# EAGLE design Termrf_v2 (EAGLE 5.07)
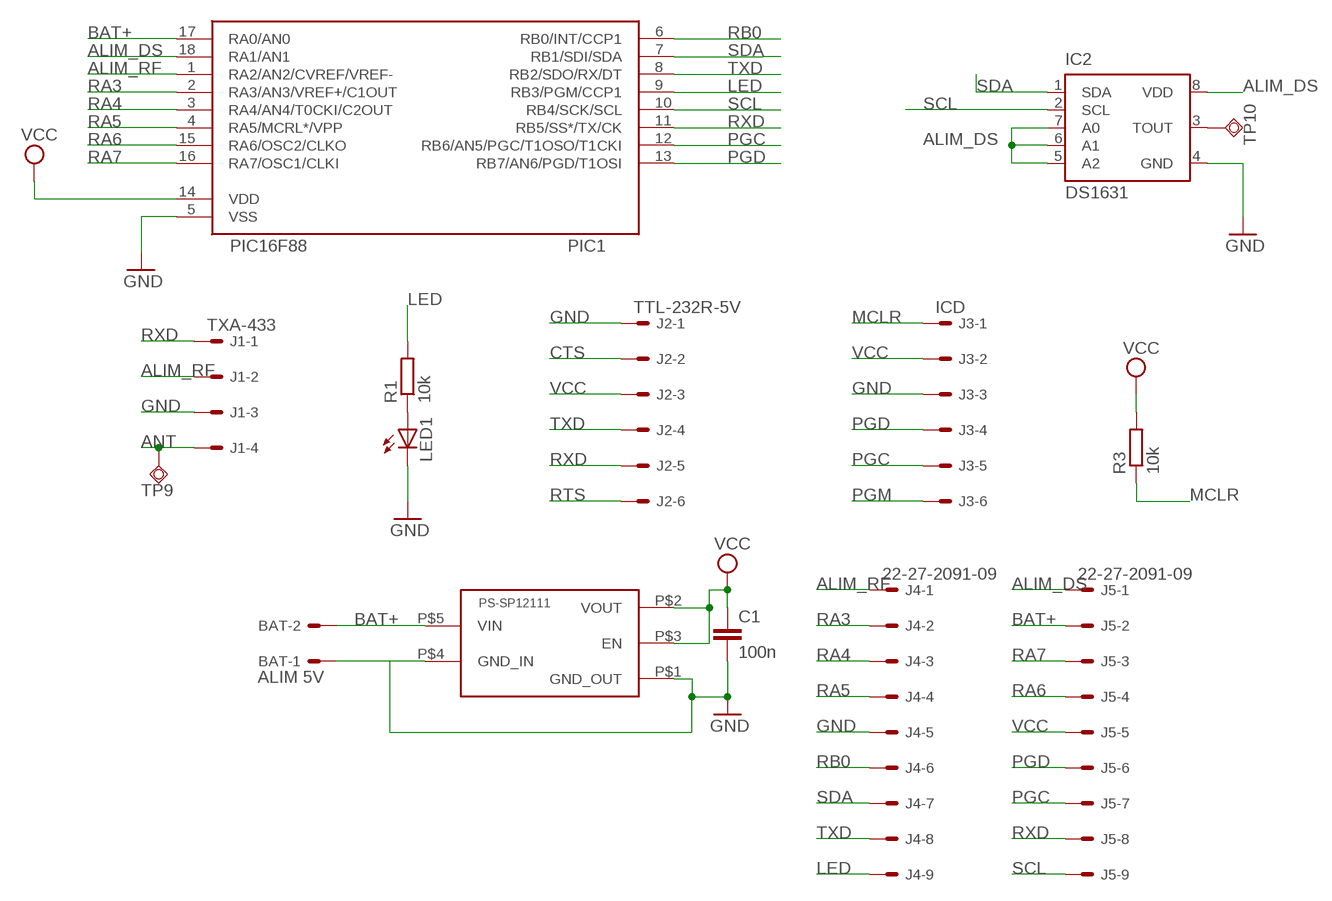
[diagram p0: schematic, sheet 1]

## Parts
BAT  ALIM 5V  22-23-2021  [22-23-2021]
C1  100n  C-EU050-035X075  [C050-035X075]
IC2  DS1631  DS1621  [DIL08]
J1  TXA-433  22-27-2041-04  [6410-04]
J2  TTL-232R-5V  22-27-2061-06  [6410-06]
J3  ICD  22-27-2061-06  [6410-06]
J4  22-27-2091-09  [6410-09]
J5  22-27-2091-09  [6410-09]
LED1  LED3MM  [LED3MM]
PIC1  PIC16F88  [DIL18]
R1  10k  R-EU_0309/10  [0309/10]
R3  10k  R-EU_0309/10  [0309/10]
TP9  TPSQPAD1-13  [P1-13]
TP10  TPSQPAD1-13  [P1-13]
U$1  PS-SP12111  [PS-SP12111]

## Nets
ALIM_DS: IC2.5(A2) IC2.6(A1) IC2.7(A0) IC2.8(VDD) J5.1 PIC1.18(RA1/AN1)
ALIM_RF: J1.2 J4.1 PIC1.1(RA2/AN2/CVREF/VREF-)
ANT: J1.4 TP9.TP
BAT+: BAT.2 J5.2 PIC1.17(RA0/AN0) U$1.P$5(VIN)
CTS: J2.2
GND: BAT.1 C1.2 IC2.4(GND) J1.3 J2.1 J3.3 J4.5 LED1.K(C) PIC1.5(VSS) U$1.P$1(GND_OUT) U$1.P$4(GND_IN)
LED: J4.9 PIC1.9(RB3/PGM/CCP1) R1.2
MCLR: J3.1 R3.1
N$1: LED1.A R1.1
N$5: IC2.3(TOUT) TP10.TP
PGC: J3.5 J5.7 PIC1.12(RB6/AN5/PGC/T1OSO/T1CKI)
PGD: J3.4 J5.6 PIC1.13(RB7/AN6/PGD/T1OSI)
PGM: J3.6
RA3: J4.2 PIC1.2(RA3/AN3/VREF+/C1OUT)
RA4: J4.3 PIC1.3(RA4/AN4/T0CKI/C2OUT)
RA5: J4.4 PIC1.4(RA5/MCRL*/VPP)
RA6: J5.4 PIC1.15(RA6/OSC2/CLKO)
RA7: J5.3 PIC1.16(RA7/OSC1/CLKI)
RB0: J4.6 PIC1.6(RB0/INT/CCP1)
RTS: J2.6
RXD: J1.1 J2.5 J5.8 PIC1.11(RB5/SS*/TX/CK)
SCL: IC2.2(SCL) J5.9 PIC1.10(RB4/SCK/SCL)
SDA: IC2.1(SDA) J4.7 PIC1.7(RB1/SDI/SDA)
TXD: J2.4 J4.8 PIC1.8(RB2/SDO/RX/DT)
VCC: C1.1 J2.3 J3.2 J5.5 PIC1.14(VDD) R3.2 U$1.P$2(VOUT) U$1.P$3(EN)

## Library data of the parts
BAT = con-molex:22-23-2021: .100" (2.54mm) Center Header - 2 Pin
C1 = resistor:C-EU: CAPACITOR, European symbol
IC2 = maxim:DS1621: Digital Thermometer and Thermostat Source: http://pdfserv.maxim-ic.com/en/ds/DS1621.pdf
J1 = con-molex:22-?-04: CONNECTOR wire to board 2.54 mm (.1 inch) pitch header
J2 J3 = con-molex:22-?-06: CONNECTOR wire to board 2.54 mm (.1 inch) pitch header
J4 J5 = con-molex:22-?-09: CONNECTOR wire to board 2.54 mm (.1 inch) pitch header
LED1 = led:LED: LED OSRAM: - CHIPLED LG R971, LG N971, LY N971, LG Q971, LY Q971, LO R971, LY R971 LH N974, LH R974 LS Q976, LO Q976, LY Q976 LO Q996 - Hyper CHIPLED LW Q18S LB Q993, LB Q99A, LB R99A - SideLED LS A670, LO A670, LY A670, LG A670, LP A670 LB A673, LV A673, LT A673, LW A673 LH A674 LY A675 LS A676, LA A676, LO A676, LY A676, LW A676 LS A679, LY A679, LG A679 - Hyper Micro SIDELED® LS Y876, LA Y876, LO Y876, LY Y876 LT Y87S - SmartLED LW L88C, LW L88S LB L89C, LB L89S, LG L890 LS L89K, LO L89K, LY L89K LS L896, LA L896, LO L896, LY L896 - TOPLED LS T670, LO T670, LY T670, LG T670, LP T670 LSG T670, LSP T670, LSY T670, LOP T670, LYG T670 LG T671, LOG T671, LSG T671 LB T673, LV T673, LT T673, LW T673 LH T674 LS T676, LA T676, LO T676, LY T676, LB T676, LH T676, LSB T676, LW T676 LB T67C, LV T67C, LT T67C, LS T67K, LO T67K, LY T67K, LW E67C LS E67B, LA E67B, LO E67B, LY E67B, LB E67C, LV E67C, LT E67C LW T67C LS T679, LY T679, LG T679 LS T770, LO T770, LY T770, LG T770, LP T770 LB T773, LV T773, LT T773, LW T773 LH T774 LS E675, LA E675, LY E675, LS T675 LS T776, LA T776, LO T776, LY T776, LB T776 LHGB T686 LT T68C, LB T68C - Hyper Mini TOPLED® LB M676 - Mini TOPLED Santana® LG M470 LS M47K, LO M47K, LY M47K Source: http://www.osram.convergy.de LUXEON: - LUMILED® LXK2-PW12-R00, LXK2-PW12-S00, LXK2-PW14-U00, LXK2-PW14-V00 LXK2-PM12-R00, LXK2-PM12-S00, LXK2-PM14-U00 LXK2-PE12-Q00, LXK2-PE12-R00, LXK2-PE12-S00, LXK2-PE14-T00, LXK2-PE14-U00 LXK2-PB12-K00, LXK2-PB12-L00, LXK2-PB12-M00, LXK2-PB14-N00, LXK2-PB14-P00, LXK2-PB14-Q00 LXK2-PR12-L00, LXK2-PR12-M00, LXK2-PR14-Q00, LXK2-PR14-R00 LXK2-PD12-Q00, LXK2-PD12-R00, LXK2-PD12-S00 LXK2-PH12-R00, LXK2-PH12-S00 LXK2-PL12-P00, LXK2-PL12-Q00, LXK2-PL12-R00 Source: www.luxeon.com KINGBRIGHT: KA-3528ASYC Source: www.kingbright.com
PIC1 = pic16f88-v0.1:PIC16F88
R1 R3 = rcl:R-EU_: RESISTOR, European symbol
TP9 TP10 = testpad:TPSQ: Test pad
U$1 = sure:PS-SP12111

## Board
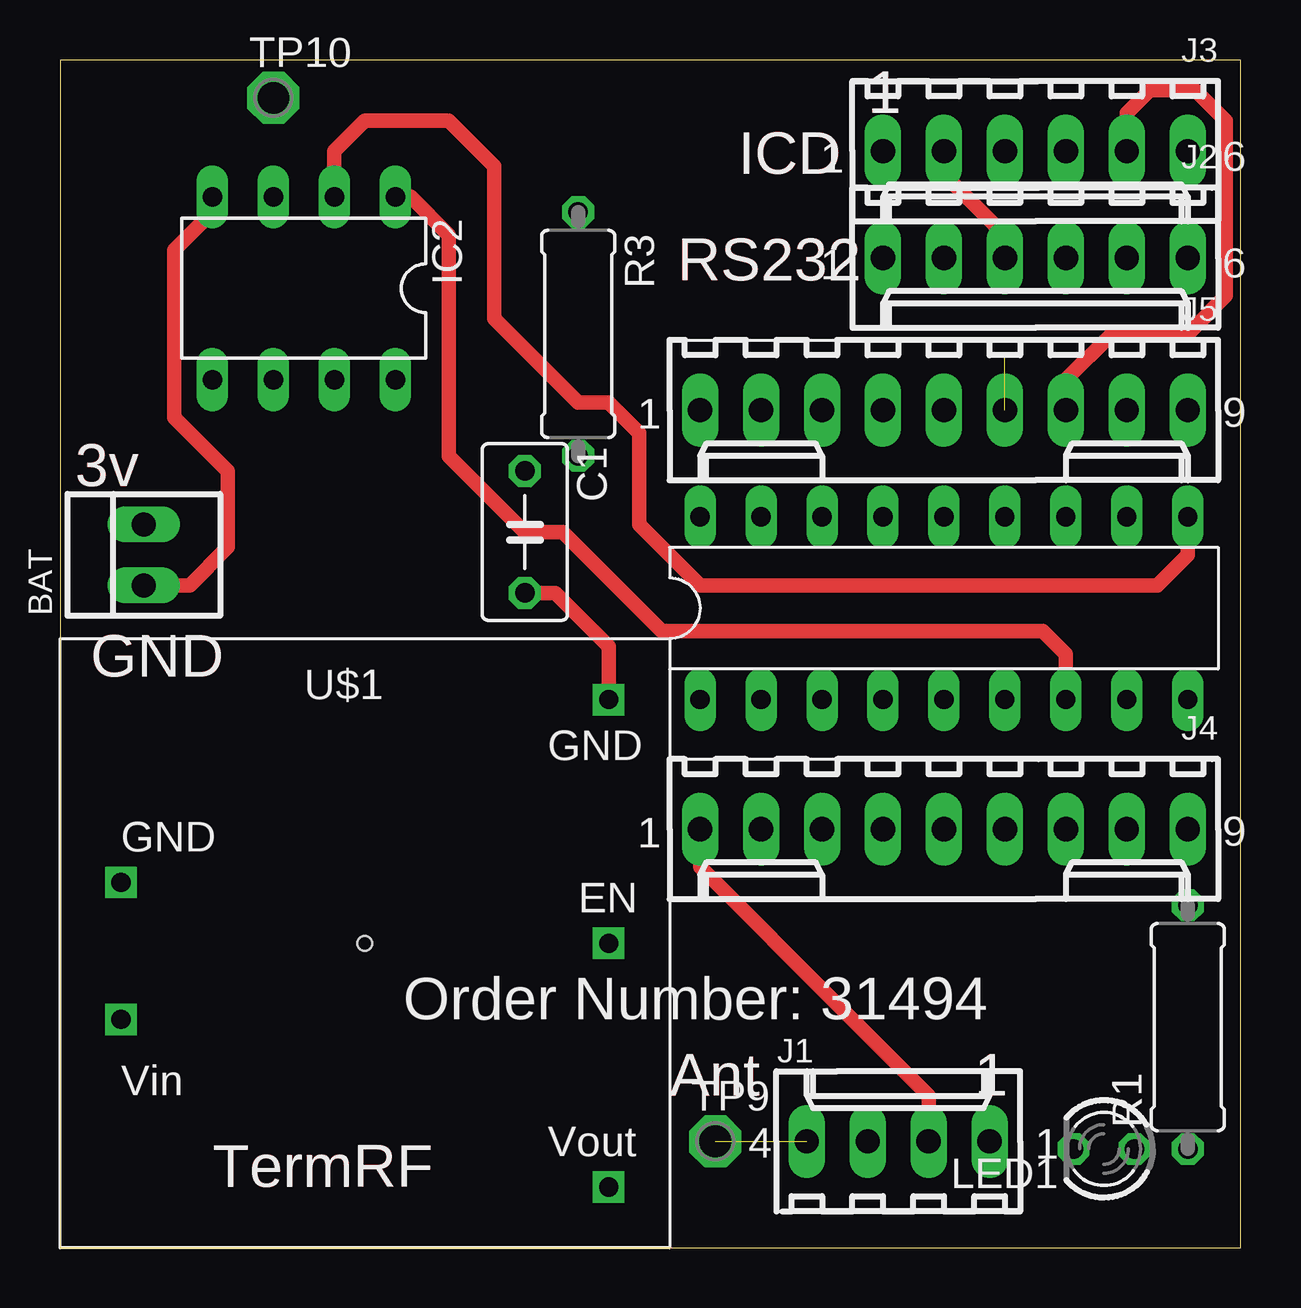
[diagram p1: board, top side]
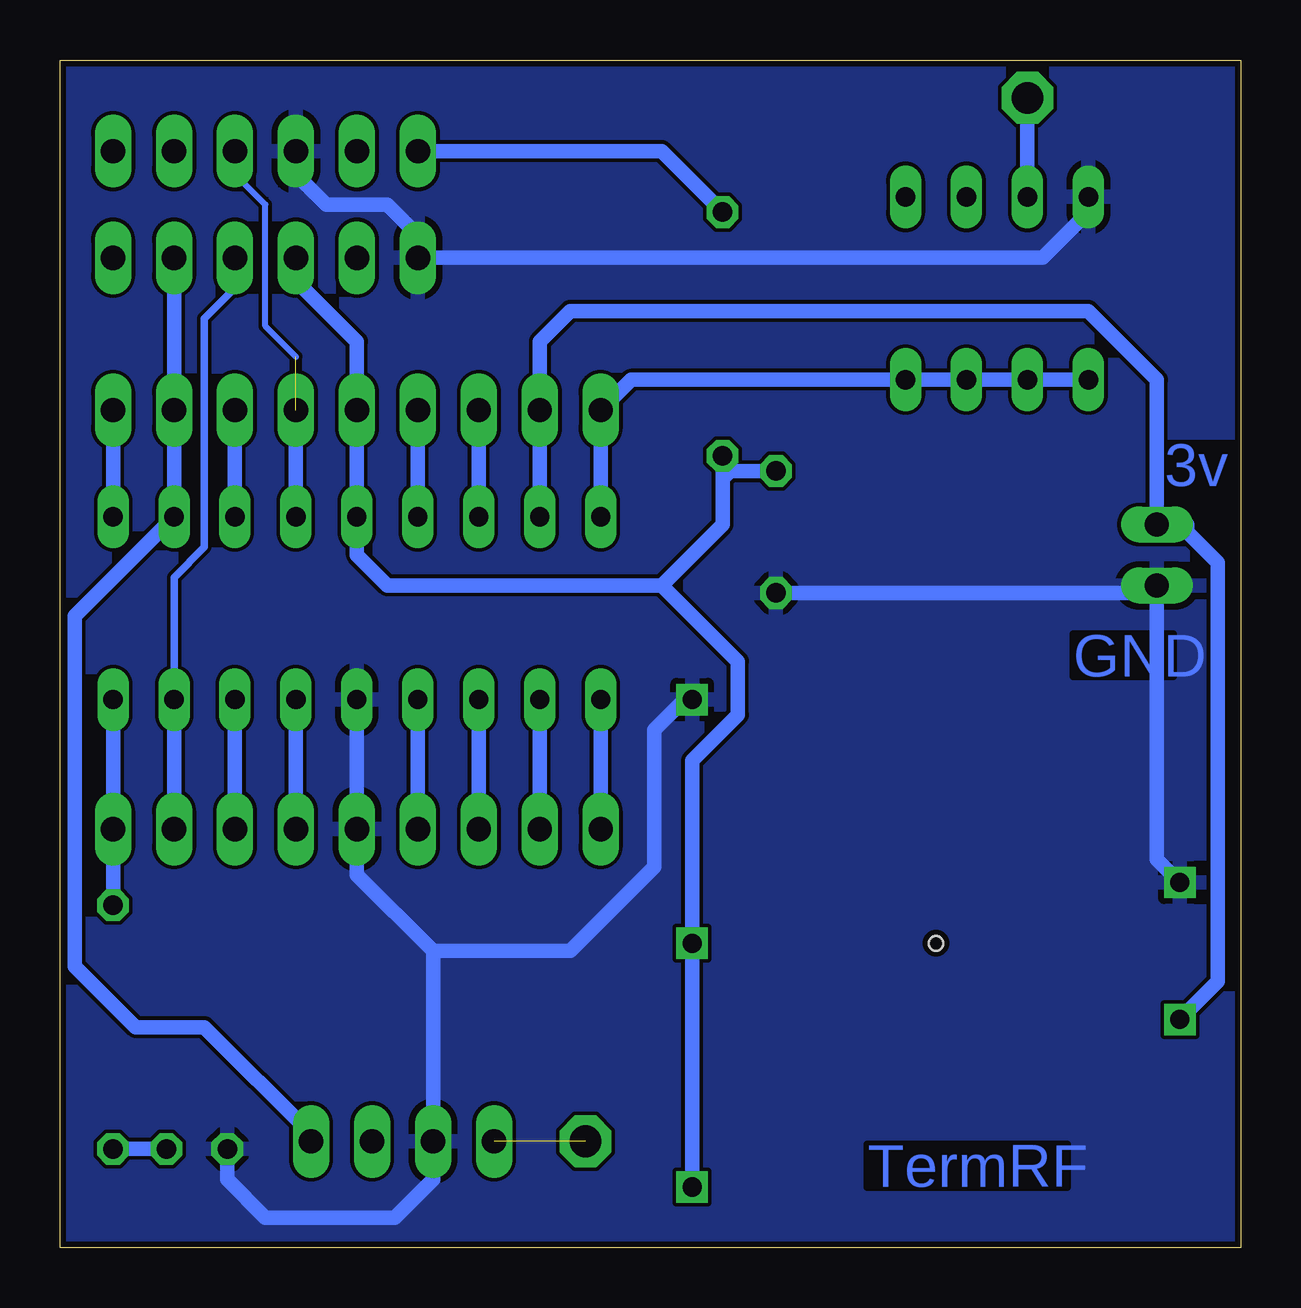
[diagram p2: board, bottom side, seen from below]

Size 49.2 x 49.52 mm. Coordinates in mm from the lower left corner, seen from the top.
Outline: 0,0 49.2,0 49.2,49.52 0,49.52 0,0
Copper layers (1*16): Top 0.035mm / dielectric 1.5mm / Bottom 0.035mm
Design rules "SeeedStudio_rule_090524": minimum track width 0.0025mm, minimum drill 10mil, track to track 6mil, track to pad 6mil, pad to pad 6mil, via to via 6mil, smd to smd 6mil, copper to edge 10mil, drill to drill 10mil, minimum pad ring 10mil, minimum via ring 6mil, stop-mask expansion 2mil, vias tented up to drill 100mil, thermal gap 10mil

### Footprints (pad centres in the part's own frame; a part is rotated, then mirrored left to right if it is on the bottom)
22-23-2021 = drill 1 long: 1 -1.27,0; 2 1.27,0
C050-035X075 = drill 0.813 octagon: 1 -2.54,0; 2 2.54,0
DIL08 = drill 0.813 long: 1 -3.81,-3.81; 2 -1.27,-3.81; 3 1.27,-3.81; 4 3.81,-3.81; 5 3.81,3.81; 6 1.27,3.81; 7 -1.27,3.81; 8 -3.81,3.81
6410-04 = drill 1.016 long: 1 3.81,0; 2 1.27,0; 3 -1.27,0; 4 -3.81,0
6410-06 = drill 1.016 long: 1 6.35,0; 2 3.81,0; 3 1.27,0; 4 -1.27,0; 5 -3.81,0; 6 -6.35,0
6410-09 = drill 1.016 long: 1 10.16,0; 2 7.62,0; 3 5.08,0; 4 2.54,0; 5 0,0; 6 -2.54,0; 7 -5.08,0; 8 -7.62,0; 9 -10.16,0
LED3MM = drill 0.813 octagon: A -1.27,0; K 1.27,0
DIL18 = drill 0.8 long: 1 -15.24,0; 2 -12.7,0; 3 -10.16,0; 4 -7.62,0; 5 -5.08,0; 6 -2.54,0; 7 0,0; 8 2.54,0; 9 5.08,0; 10 5.08,7.62; 11 2.54,7.62; 12 0,7.62; 13 -2.54,7.62; 14 -5.08,7.62; 15 -7.62,7.62; 16 -10.16,7.62; 17 -12.7,7.62; 18 -15.24,7.62
0309/10 = drill 0.813 octagon: 1 -5.08,0; 2 5.08,0
P1-13 = drill 1.321 pad 2.159 octagon: TP 0,0
PS-SP12111 = drill 0.8 square: P$1 10.16,10.16; P$2 10.16,-10.16; P$3 10.16,0; P$4 -10.16,2.54; P$5 -10.16,-3.175 | hole 0.6: 0,0

### Placement (x,y rotation side)
BAT  3.49,28.89 90 top
C1  19.37,29.84 270 top
IC2  10.16,40.01 180 top
J1  34.92,4.45 0 top
J2  40.64,41.27 180 top
J3  40.64,45.72 180 top
J4  36.83,17.46 180 top
J5  36.83,34.92 180 top
LED1  43.5,4.13 180 top
PIC1  41.91,22.86 0 top
R1  46.99,9.21 90 top
R3  21.59,38.1 270 top
TP9  27.3,4.45 0 top
TP10  8.89,47.94 0 top
U$1  12.7,12.7 0 top

### Tracks (layer width: path | path; a pad name or v marks a point on that pad's centre or on a via)
ALIM_DS
  Bottom 0.61: PIC1.18 J5.1 25.4,36.2 IC2.8 IC2.7 IC2.6 IC2.5
ALIM_RF
  Top 0.61: J4.1 26.67,15.88 32.7,9.84 33.02,9.53 36.2,6.35 J1.2
  Bottom 0.61: J4.1 PIC1.1
ANT  (1 unrouted)
BAT+
  Bottom 0.61: PIC1.17 J5.2 29.21,37.78 27.94,39.05 6.35,39.05 3.49,36.2 BAT.2 2.22,30.16 2.22,29.84 0.95,28.57 0.95,11.11 U$1.P$5
GND
  Top 0.61: BAT.1 5.4,27.62 6.99,29.21 6.99,32.38 4.76,34.61 4.76,41.59 6.35,43.18 IC2.4 | U$1.P$1 22.86,25.08 20.64,27.3 C1.2
  Bottom 0.61: U$1.P$4 3.49,16.19 BAT.1 3.81,27.3 C1.2 | PIC1.5 J4.5 36.83,15.56 33.66,12.38 | IC2.4 6.35,43.18 8.26,41.27 J2.1 34.29,42.23 35.56,43.5 38.1,43.5 39.37,44.77 J3.3 | U$1.P$1 23.18,22.86 24.45,21.59 24.45,15.88 27.94,12.38 33.66,12.38 | LED1.K 42.23,2.86 40.64,1.27 35.24,1.27 33.66,2.86 J1.3 33.66,12.38
  pour Bottom: 0.32,49.21 48.9,49.21 48.9,0.32 0.32,0.32
LED
  Bottom 0.61: R1.2 J4.9 PIC1.9
MCLR
  Bottom 0.61: J3.1 24.13,45.72 R3.1
N$1
  Bottom 0.61: LED1.A R1.1
N$5
  Bottom 0.61: IC2.3 TP10.TP
PGC
  Top 0.61: J5.7 41.91,36.2 43.81,38.1 46.99,38.1 48.58,39.69 48.58,46.99 47.31,48.26 45.4,48.26 44.45,47.31 J3.5
  Bottom 0.61: PIC1.12 J5.7
PGD  (1 unrouted)
  Bottom 0.254: J3.4 41.91,44.77 40.64,43.5 40.64,38.42 39.37,37.15
  Bottom 0.61: PIC1.13 J5.6
RA3
  Bottom 0.61: J4.2 PIC1.2
RA4
  Bottom 0.61: J4.3 PIC1.3
RA5
  Bottom 0.61: J4.4 PIC1.4
RA6
  Bottom 0.61: PIC1.15 J5.4
RA7
  Bottom 0.61: PIC1.16 J5.3
RB0
  Bottom 0.61: J4.6 PIC1.6
RXD
  Bottom 0.61: J2.5 J5.8 PIC1.11 48.58,26.35 48.58,11.75 46.04,9.21 43.18,9.21 38.73,4.76 J1.1
SCL
  Top 0.61: IC2.2 11.43,45.72 12.7,46.99 16.19,46.99 18.1,45.09 18.1,38.73 21.59,35.24 22.86,35.24 24.13,33.97 24.13,30.16 26.67,27.62 45.72,27.62 46.99,28.89 PIC1.10
  Bottom 0.61: PIC1.10 J5.9
SDA
  Top 0.61: IC2.1 14.61,43.81 16.19,42.23 16.19,33.02 19.37,29.84 20.95,29.84 25.08,25.72 40.96,25.72 41.91,24.77 PIC1.7
  Bottom 0.61: PIC1.7 J4.7
TXD
  Bottom 0.254: J2.4 41.91,41.59
  Bottom 0.305: PIC1.8 44.45,27.94 43.18,29.21 43.18,38.73 41.91,40.01 J2.4
  Bottom 0.61: J4.8 PIC1.8
VCC
  Top 0.61: J2.3 39.37,42.23 36.83,44.77 J3.2
  Bottom 0.61: U$1.P$2 U$1.P$3 22.86,20.32 20.95,22.23 20.95,24.45 24.13,27.62 | 24.13,27.62 35.56,27.62 36.83,28.89 PIC1.14 J5.5 36.83,37.78 39.37,40.32 J2.3 | 21.59,32.07 21.59,30.16 24.13,27.62 | 21.59,32.07 R3.2 | C1.1 21.27,32.38 21.59,32.07

### Text on the board
Top: 1 | ICD | RS232 | 3v | GND | Ant | 1 | TermRF
Bottom: 3v | GND | TermRF
tNames: 1 | ICD | RS232 | 3v | GND | Order Number: 31494 | Ant | 1 | TermRF